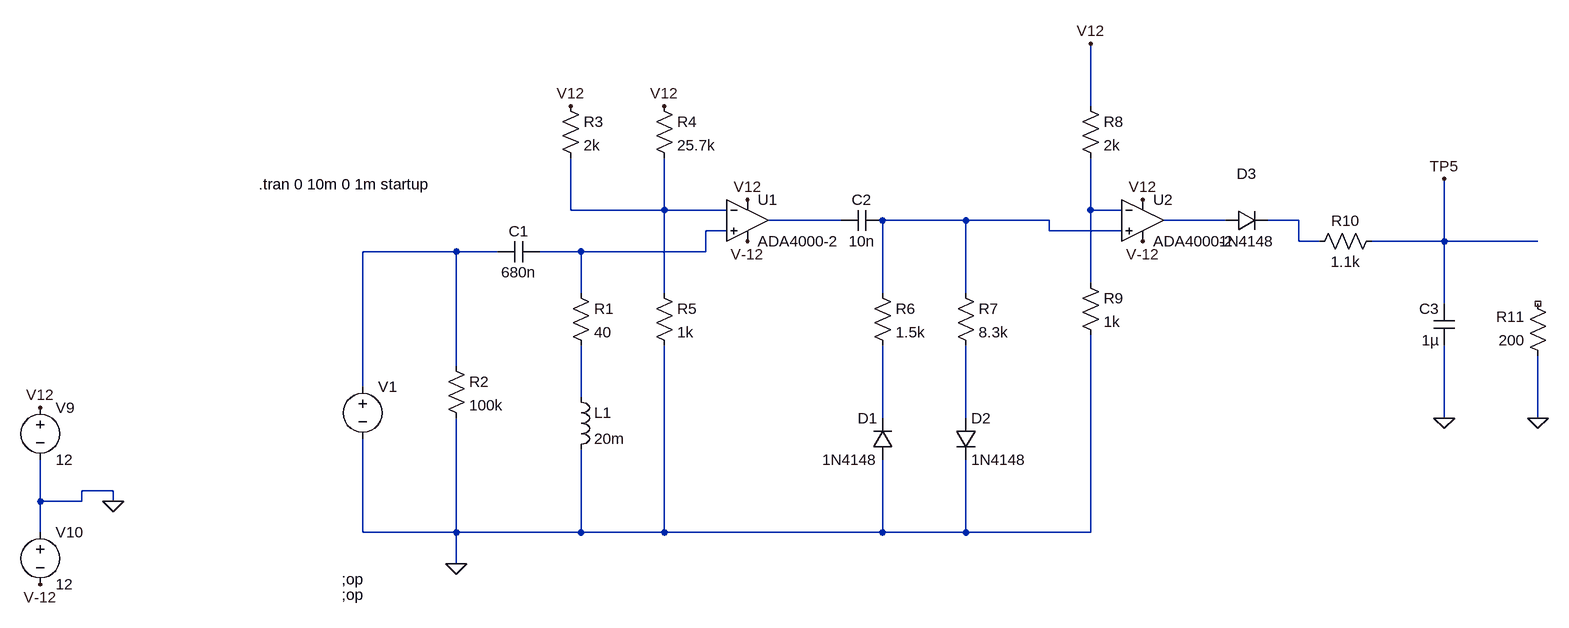
[diagram p0: schematic Télécommande.asc]
Télécommande.asc, the LTspice schematic file:
Version 4
SHEET 1 2004 680
WIRE 1232 -384 1232 -480
WIRE 432 -224 432 -304
WIRE 576 -224 576 -304
WIRE 576 -224 432 -224
WIRE 672 -224 576 -224
WIRE 1232 -224 1232 -304
WIRE 1280 -224 1232 -224
WIRE 848 -208 736 -208
WIRE 912 -208 896 -208
WIRE 1040 -208 912 -208
WIRE 1168 -208 1040 -208
WIRE 1440 -208 1344 -208
WIRE 1552 -208 1504 -208
WIRE 672 -192 640 -192
WIRE 1168 -192 1168 -208
WIRE 1280 -192 1168 -192
WIRE 1552 -176 1552 -208
WIRE 1584 -176 1552 -176
WIRE 1776 -176 1776 -272
WIRE 1776 -176 1664 -176
WIRE 1920 -176 1776 -176
WIRE 256 -160 112 -160
WIRE 320 -160 256 -160
WIRE 448 -160 384 -160
WIRE 640 -160 640 -192
WIRE 640 -160 448 -160
WIRE 1232 -112 1232 -224
WIRE 448 -96 448 -160
WIRE 576 -96 576 -224
WIRE 912 -96 912 -208
WIRE 1040 -96 1040 -208
WIRE 1776 -80 1776 -176
WIRE 256 16 256 -160
WIRE 112 48 112 -160
WIRE 448 64 448 -16
WIRE 912 96 912 -16
WIRE 1040 96 1040 -16
WIRE 1776 96 1776 -16
WIRE 1920 96 1920 0
WIRE -272 208 -320 208
WIRE -384 224 -384 160
WIRE -320 224 -320 208
WIRE -320 224 -384 224
WIRE -272 224 -272 208
WIRE -384 272 -384 224
WIRE 112 272 112 128
WIRE 256 272 256 96
WIRE 256 272 112 272
WIRE 448 272 448 144
WIRE 448 272 256 272
WIRE 576 272 576 -16
WIRE 576 272 448 272
WIRE 912 272 912 160
WIRE 912 272 576 272
WIRE 1040 272 1040 160
WIRE 1040 272 912 272
WIRE 1232 272 1232 -32
WIRE 1232 272 1040 272
WIRE 256 320 256 272
FLAG 1776 96 0
FLAG 1920 96 0
FLAG 256 320 0
FLAG -272 224 0
FLAG -384 80 V12
FLAG 432 -384 V12
FLAG 576 -384 V12
FLAG 704 -240 V12
FLAG 1312 -240 V12
FLAG 1232 -480 V12
FLAG -384 352 V-12
FLAG 704 -176 V-12
FLAG 1312 -176 V-12
FLAG 1776 -272 TP5
SYMBOL voltage 112 32 R0
WINDOW 123 0 0 Left 0
WINDOW 39 0 0 Left 0
SYMATTR InstName V1
SYMATTR Value ""
SYMBOL res 432 -112 R0
SYMATTR InstName R1
SYMATTR Value 40
SYMBOL res 240 0 R0
SYMATTR InstName R2
SYMATTR Value 100k
SYMBOL cap 384 -176 R90
WINDOW 0 0 32 VBottom 2
WINDOW 3 32 32 VTop 2
SYMATTR InstName C1
SYMATTR Value 680n
SYMBOL ind 432 48 R0
SYMATTR InstName L1
SYMATTR Value 20m
SYMBOL res 416 -400 R0
SYMATTR InstName R3
SYMATTR Value 2k
SYMBOL res 560 -400 R0
SYMATTR InstName R4
SYMATTR Value 25.7k
SYMBOL res 560 -112 R0
SYMATTR InstName R5
SYMATTR Value 1k
SYMBOL res 896 -112 R0
SYMATTR InstName R6
SYMATTR Value 1.5k
SYMBOL res 1024 -112 R0
SYMATTR InstName R7
SYMATTR Value 8.3k
SYMBOL res 1216 -400 R0
SYMATTR InstName R8
SYMATTR Value 2k
SYMBOL res 1216 -128 R0
SYMATTR InstName R9
SYMATTR Value 1k
SYMBOL res 1680 -192 R90
WINDOW 0 0 56 VBottom 2
WINDOW 3 32 56 VTop 2
SYMATTR InstName R10
SYMATTR Value 1.1k
SYMBOL res 1936 16 R180
WINDOW 0 36 76 Left 2
WINDOW 3 36 40 Left 2
SYMATTR InstName R11
SYMATTR Value 200
SYMBOL cap 912 -224 R90
WINDOW 0 0 32 VBottom 2
WINDOW 3 32 32 VTop 2
SYMATTR InstName C2
SYMATTR Value 10n
SYMBOL cap 1792 -16 R180
WINDOW 0 24 56 Left 2
WINDOW 3 24 8 Left 2
SYMATTR InstName C3
SYMATTR Value 1µ
SYMBOL OpAmps\\ADA4000-2 1312 -272 R0
SYMATTR InstName U2
SYMBOL diode 928 160 R180
WINDOW 0 24 64 Left 2
WINDOW 3 24 0 Left 2
SYMATTR InstName D1
SYMATTR Value 1N4148
SYMATTR Description Light Emitting Diode
SYMATTR Type led
SYMBOL diode 1024 96 R0
SYMATTR InstName D2
SYMATTR Value 1N4148
SYMATTR Description Light Emitting Diode
SYMATTR Type led
SYMBOL diode 1440 -192 R270
WINDOW 0 72 32 VTop 2
WINDOW 3 0 32 VBottom 2
SYMATTR InstName D3
SYMATTR Value 1N4148
SYMATTR Description Light Emitting Diode
SYMATTR Type led
SYMBOL OpAmps\\ADA4000-2 704 -272 R0
SYMATTR InstName U1
SYMBOL voltage -384 64 R0
SYMATTR InstName V9
SYMATTR Value 12
SYMBOL voltage -384 256 R0
SYMATTR InstName V10
SYMATTR Value 12
TEXT 80 344 Left 2 !;op
TEXT 80 368 Left 2 !;op
TEXT -48 -264 Left 2 !.tran 0 10m 0 1m startup

The netlist it stands for:
* Télécommande.asc
V1 N008 0
R1 N007 N009 40
R2 N008 0 100k
C1 N007 N008 680n
L1 N009 0 20m
R3 V12 N001 2k
R4 V12 N001 25.7k
R5 N001 0 1k
R6 N004 N010 1.5k
R7 N004 N011 8.3k
R8 V12 N002 2k
R9 N002 0 1k
R10 TP5 N006 1.1k
R11 0 NC_01 200
C2 N004 N003 10n
C3 0 TP5 1µ
XU2 N004 N002 V12 V-12 N005 ADA4000-2  ; pins In+ In- V+ V- OUT
D1 0 N010 1N4148
D2 N011 0 1N4148
D3 N005 N006 1N4148
XU1 N007 N001 V12 V-12 N003 ADA4000-2  ; pins In+ In- V+ V- OUT
V9 V12 0 12
V10 0 V-12 12
.model D D
.lib standard.dio
;op
;op
.tran 0 10m 0 1m startup
.backanno
.end